# EAGLE schematic nixie (EAGLE 7.7.0)
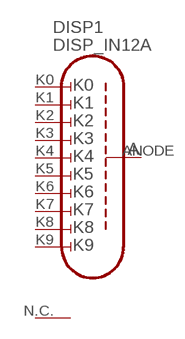
[diagram p0: schematic, sheet 1]

## Parts
DISP1  DISP_IN12A  [DISP_IN-12_SOCKET]
Unconnected: DISP1.ANODE DISP1.K0 DISP1.K1 DISP1.K2 DISP1.K3 DISP1.K4 DISP1.K5 DISP1.K6 DISP1.K7 DISP1.K8 DISP1.K9 DISP1.N.C.

## Library data of the parts
DISP1 = dp_devices:DISP_IN12A: IN-12A Nixie Display